# Altium schematic sheet MCont_V1.0.SchDoc
size 381 x 241 mm; SheetNumber: 1; SheetTotal: 5
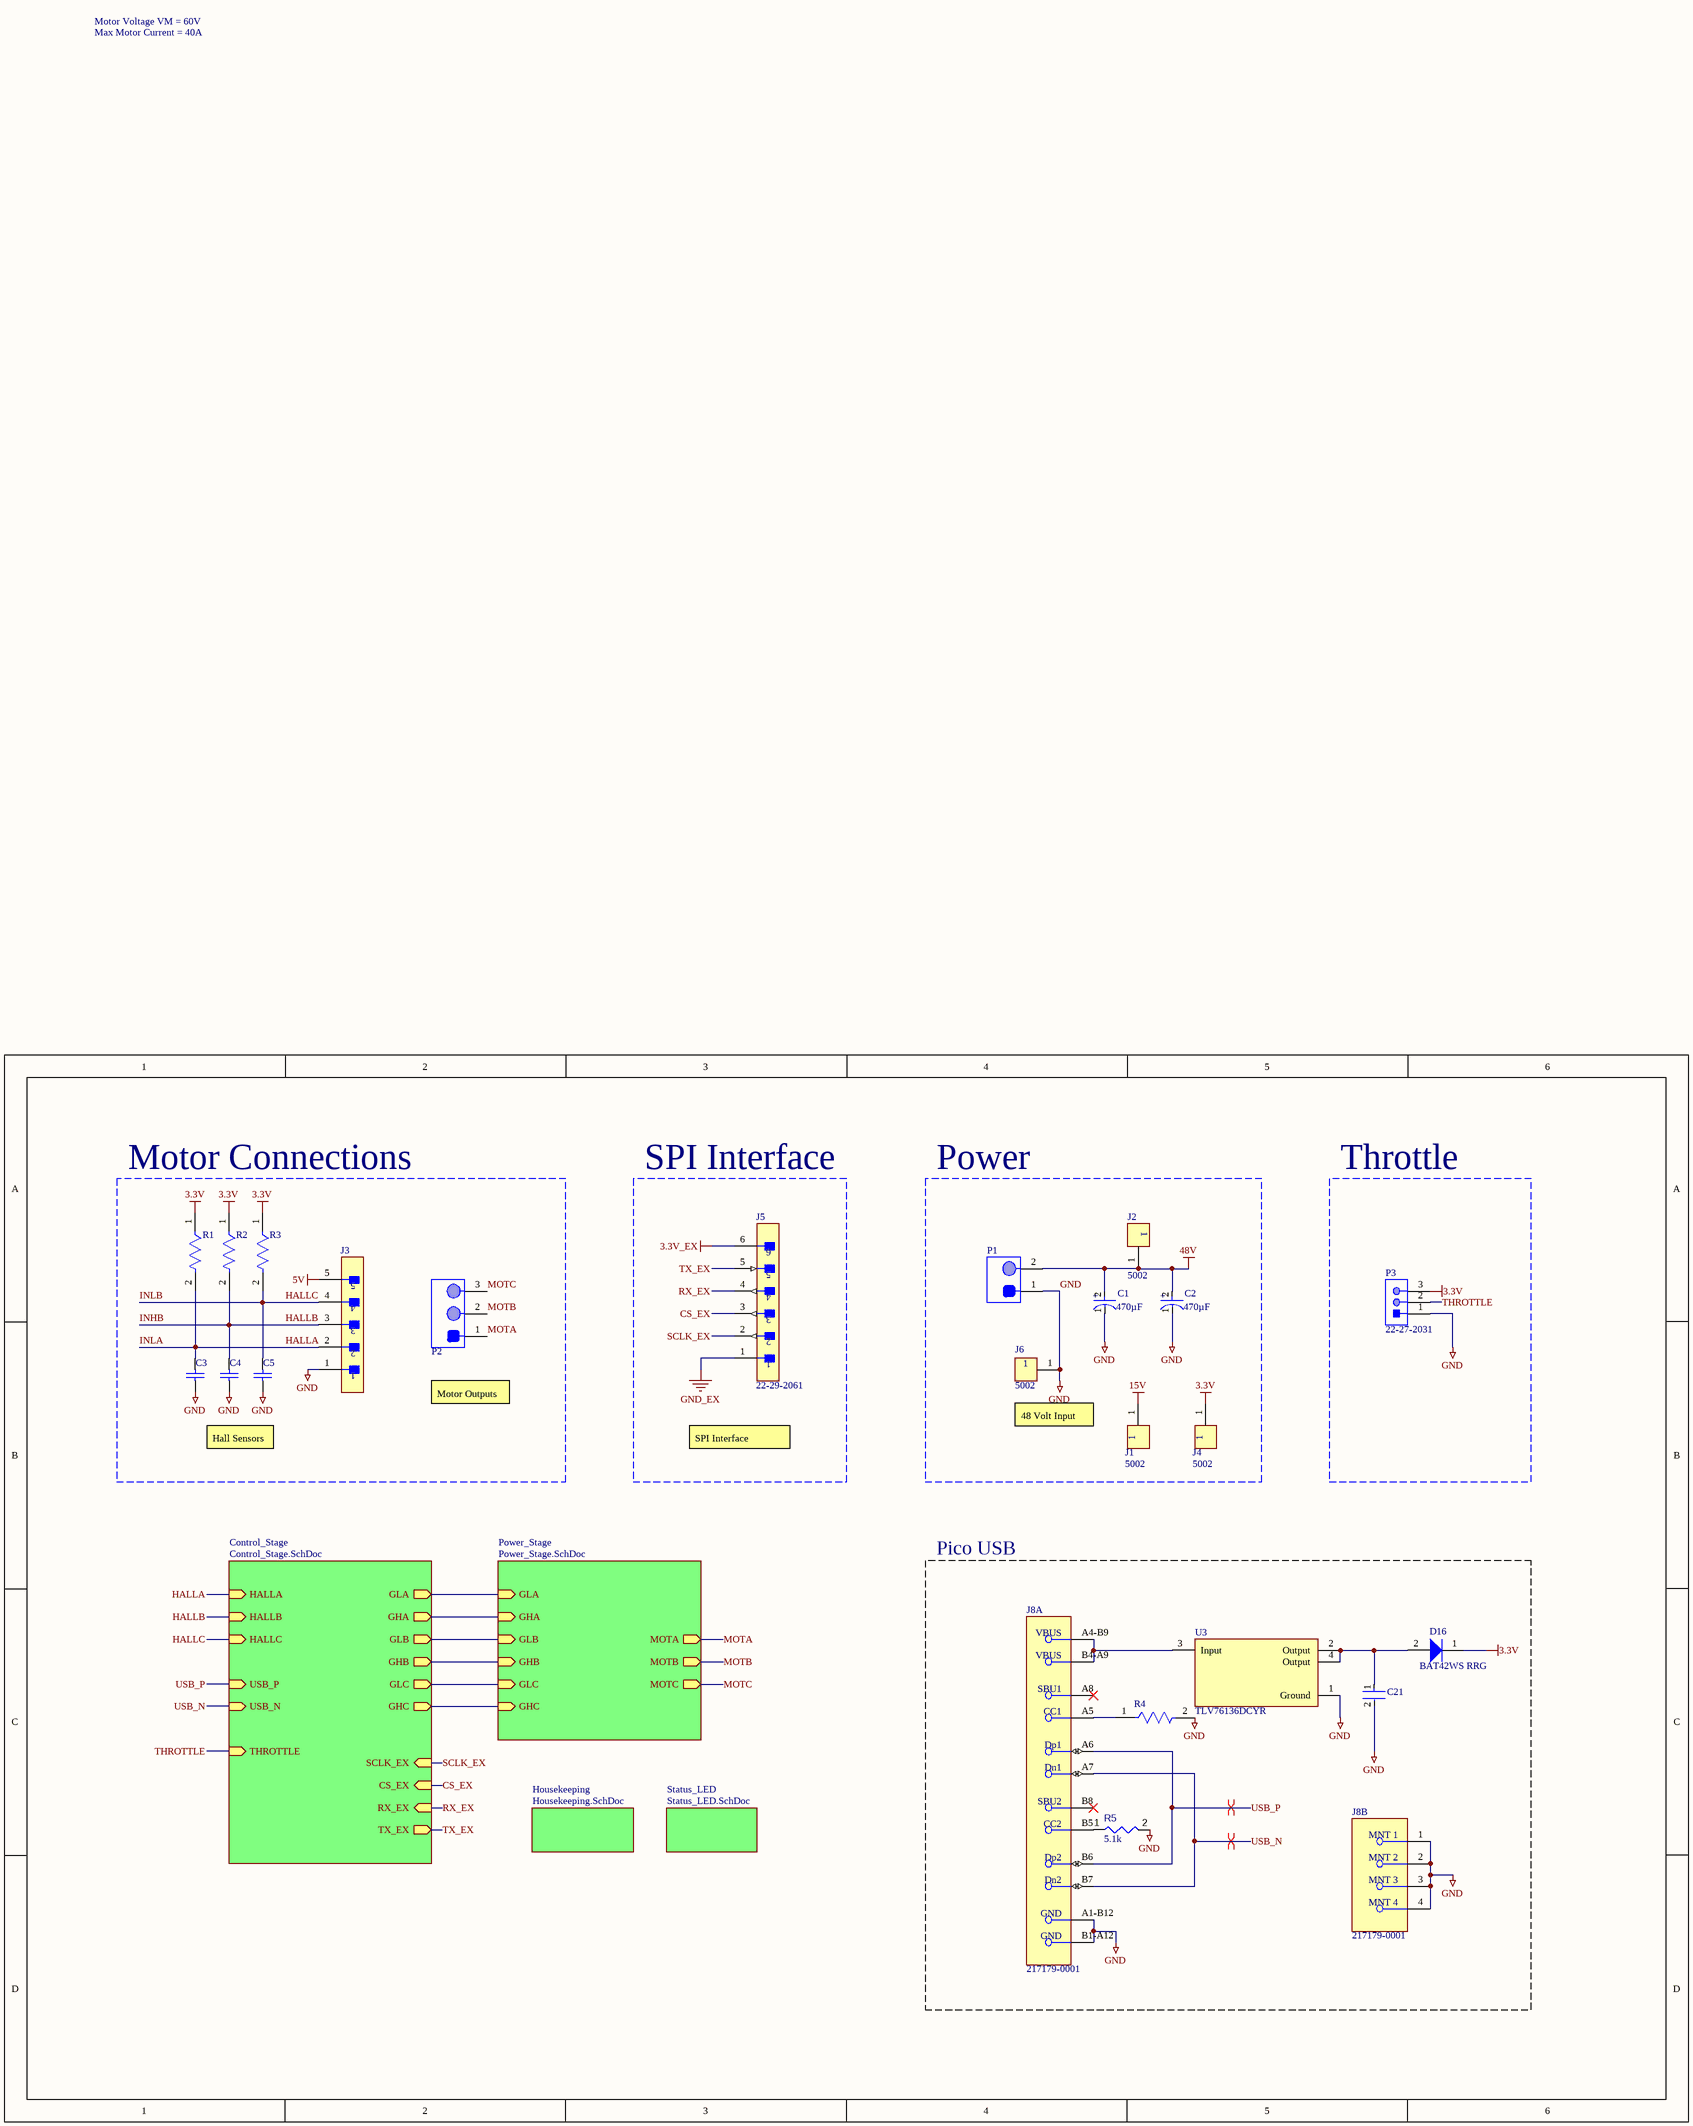
[diagram p0: MCont_V1.0.SchDoc]

## Parts
C1  Capacitance: 470µF  [FP-ESH477M100AM2AA-MFG]  (hidden comment: ESH477M100AM2AA)
C2  Capacitance: 470µF  [FP-ESH477M100AM2AA-MFG]  (hidden comment: ESH477M100AM2AA)
C3  VJ0603Y102KXACW1BC  [CAPC1608X95X40NL15T15]  (value not drawn)
C4  VJ0603Y102KXACW1BC  [CAPC1608X95X40NL15T15]  (value not drawn)
C5  VJ0603Y102KXACW1BC  [CAPC1608X95X40NL15T15]  (value not drawn)
C21  CC0603KRX5R6BB106  [FP-CC0603-DC-MFG]  (value not drawn)
D16  BAT42WS RRG  [BAT42WS RRG-Footprint-1]
J1  5002  [FP-5002-MFG]
J2  5002  [FP-5002-MFG]
J3  22-29-2051  [FP-22-29-2051-MFG]  (value not drawn)
J4  5002  [FP-5002-MFG]
J5  22-29-2061  [FP-22-29-2061-MFG]
J6  5002  [FP-5002-MFG]
J8  217179-0001  [FP-2171790001-MFG]  (parts A,B of 2)
P1  VP0265540000G  [VP0265540000G-Footprint-1]  (value not drawn)
P2  VP0365540000G  [VP0365540000G-Footprint-1]  (value not drawn)
P3  22-27-2031  [MOLX-22-27-2031_V]
R1  RC0603FR-0710KL  [FP-RC0603-0_55-IPC_C]  (value not drawn)
R2  RC0603FR-0710KL  [FP-RC0603-0_55-IPC_C]  (value not drawn)
R3  RC0603FR-0710KL  [FP-RC0603-0_55-IPC_C]  (value not drawn)
R4  ERJ-3EKF5101V  [FP-ERJ3EK-MFG]  (value not drawn)
R5  value 5.1k  [FP-ERJ3EK-IPC_A]  (hidden comment: ERJ-3EKF5101V)
U3  TLV76136DCYR  [TLV76136DCYR-Footprint-1]

## Blocks framed on the sheet
Motor Connections: C3-C5 J3 P2 R1-R3
SPI Interface: J5
Power: C1 C2 J1 J2 J4 J6 P1
Throttle: P3
Pico USB: C21 D16 J8 R4 R5 U3

## Sub-sheets
Control_Stage = Control_Stage.SchDoc: HALLA (in), HALLB (in), HALLC (in), USB_P (in), USB_N (in), GLA (out), GHA (out), GLB (out), GHB (out), GLC (out), GHC (out), THROTTLE (in), SCLK_EX (in), CS_EX (in), RX_EX (in), TX_EX (out)
Housekeeping = Housekeeping.SchDoc: no entries
Power_Stage = Power_Stage.SchDoc: MOTA (out), MOTB (out), MOTC (out), GLA (in), GHA (in), GLB (in), GHB (in), GLC (in), GHC (in)
Status_LED = Status_LED.SchDoc: no entries

## Nets
3.3V: D16.1(K) J4.1 P3.3 R1.1 R2.1 R3.1
3.3V_EX: J5.6
5V: J3.5
15V: J1.1
48V: C1.2(A) C2.2(A) J2.1 P1.2
GND: C1.1(C) C2.1(C) C3.1 C4.1 C5.1 C21.2 J3.1 J6.1 J8.1(MNT_1) J8.2(MNT_2) J8.3(MNT_3) J8.4(MNT_4) J8.A1-B12(GND) J8.B1-A12(GND) P1.1 P3.1 R4.2 R5.2 U3.1(Ground)
GND_EX: J5.1
CS_EX: J5.3 ; sheet Control_Stage/CS_EX
HALLA: C3.2 J3.2 R1.2 ; sheet Control_Stage/HALLA  [also labelled INLA]
HALLB: C4.2 J3.3 R2.2 ; sheet Control_Stage/HALLB  [also labelled INHB]
HALLC: C5.2 J3.4 R3.2 ; sheet Control_Stage/HALLC  [also labelled INLB]
MOTA: P2.1 ; sheet Power_Stage/MOTA
MOTB: P2.2 ; sheet Power_Stage/MOTB
MOTC: P2.3 ; sheet Power_Stage/MOTC
RX_EX: J5.4 ; sheet Control_Stage/RX_EX
SCLK_EX: J5.2 ; sheet Control_Stage/SCLK_EX
THROTTLE: P3.2 ; sheet Control_Stage/THROTTLE
TX_EX: J5.5 ; sheet Control_Stage/TX_EX
USB_N: J8.A7(Dn1) J8.B7(Dn2) ; sheet Control_Stage/USB_N
USB_P: J8.A6(Dp1) J8.B6(Dp2) ; sheet Control_Stage/USB_P
NetC21_1: C21.1 D16.2(A) U3.2(Output) U3.4(Output)
NetJ8_A4-B9: J8.A4-B9(VBUS) J8.B4-A9(VBUS) U3.3(Input)
NetJ8_A5: J8.A5(CC1) R4.1
NetJ8_B5: J8.B5(CC2) R5.1
(unnamed): sheet Power_Stage/GLA, sheet Control_Stage/GLA
(unnamed): sheet Power_Stage/GHA, sheet Control_Stage/GHA
(unnamed): sheet Power_Stage/GLB, sheet Control_Stage/GLB
(unnamed): sheet Power_Stage/GHB, sheet Control_Stage/GHB
(unnamed): sheet Power_Stage/GLC, sheet Control_Stage/GLC
(unnamed): sheet Power_Stage/GHC, sheet Control_Stage/GHC

Not connected (* = marked no-connect by the designer): J8 A8(SBU1)* B8(SBU2)*

## Layout directives
differential pair: USB_N, USB_P

## Notes on the sheet
- Motor Voltage VM = 60V
- Max Motor Current = 40A
- Motor Outputs
- Hall Sensors
- SPI Interface
- 48 Volt Input
- (in symbol CMP-00212-26722299-1) +

## Library data of the parts
C1 C2 = CMP-00212-26722299-1: ESH477M100AM2AA Radial Can ALUMINUM ELECTROLYTIC CAPACITOR ESH 100V 470muF ±20% 0.630Dia 16.00mm; Life (Hours): 2000hours; Case/Package: Radial; Height: 32mm; REACH SVHC: No SVHC; Voltage Rating: 100V; Min Operating Temperature: -25°C; Diameter: 16mm; Voltage Rating (DC): 100V; Max Operating Temperature: 105°C; RoHS: Compliant; Packaging: Tape & Reel; Tolerance: 20%; Lead Pitch: 7.5mm; NexarPartId: 26722299
C3-C5 = CMP-2006-02121-1: Manufacturer: Vitramon; Part Number: VJ0603Y102KXACW1BC
C21 = CMP-03422-001507-1: CAP CER 10UF 10V X5R 0603; Tolerance: 10%; Case/Package: 0603; Length: 0.063inch; Capacitance: 10uF; Dielectric: X5R; Mount: Surface Mount; Case Code (Metric): 1608; Depth: 0.8mm; Voltage Rating (DC): 10V; Voltage Rating: 10V; Lead Free: Lead Free; Resistor Type: Ceramic; Packaging: Tape and Reel; Max Operating Temperature: 85°C; Termination: SMD/SMT; Min Operating Temperature: -55°C; Weight: 7.1E-05oz; Thickness: 0.035inch; Case Code (Imperial): 0603; Package Quantity: 4000; Halogen Free: Halogen Free; RoHS Compliant: Yes; Width: 0.031inch
D16 = CMP-004-00032-1: Schottky Diode, 30V, 0.2A, Sod-323F Rohs Compliant: Yes; Manufacturer Lifecycle Status: ACTIVE; Lifecycle Status: Production
J1 J2 J4 J6 = CMP-2000-05182-2: PC TEST POINT MINIATURE WHITE; Body Material: Bronze; Insulation: Insulated; Inside Diameter: 1.27mm; Number of Ports: 1; Outside Diameter: 2.54mm; Hole Diameter: 1.6mm; Plating: Silver; Contact Plating: Silver; Orientation: Straight; REACH SVHC: No SVHC; Series: THM; Packaging: Bulk; Material: Nylon; Flammability Rating: UL94 V-0; Mount: Through Hole; Color: White; Housing Color: White; Length: 7.62mm; Contact Material: Bronze; Lead Free: Lead Free; Package Quantity: 100; RoHS Compliant: Yes
J3 = CMP-04776-000816-1: 2.54MM KK HDR VT FRICLK VRA .5AU; Number of Circuits: 5; Connector Type: Male Pin; Max Current Rating: 7A; Glow Wire Compliant: Non-compliant; Insulation Resistance: 50GR; Gender: Male; Current Rating: 4A; Number of Lines: 1; Max Voltage Rating (AC): 250V; Contact Resistance: 10mR; Orientation: Straight; Height: 14.73mm; Contact Plating: Gold; Series: KK® 6410; Number of Poles: 5; Mount: Through Hole; Length: 12.7mm; Packaging: Bulk; Package Quantity: 10; Depth: 5.8mm; Housing Color: White; Pitch: 2.54mm; Number of Positions: 5; Contact Mating Length: 0.295inch; Max Operating Temperature: 75°C; Housing Material: Nylon; Termination: Solder; Contact Material: Brass; Flammability Rating: UL94 V-0; Number of Contacts: 5; Color: Natural; Min Operating Temperature: 0°C; Radiation Hardening: No; Contact Type: Male Pin; Number of Rows: 1; Voltage Rating: 250V; Voltage Rating (DC): 250V; Contact Gender: Male; Fastening Type: Friction; Lead Free: Lead Free; Halogen Free: Low Halogen
J5 = CMP-04776-000348-1: CONN HEADER VERT 6POS 2.54MM; Gender: Male; Number of Poles: 6; Voltage Rating: 250V; Insulation Resistance: 50GR; Contact Resistance: 10mR; Current Rating: 4A; Number of Lines: 1; Height: 11.7mm; Mount: Through Hole; Length: 15.24mm; Contact Plating: Gold; Contact Type: Male Pin; Contact Material: Brass; Housing Material: Nylon; Series: KK® 6410; Number of Positions: 6; Contact Mating Length: 0.295inch; Fastening Type: Friction; RoHS Compliant: Yes; Color: Natural; Max Operating Temperature: 75°C; Contact Gender: Male; Packaging: Bulk; Termination: Solder; Voltage Rating (DC): 250V; Orientation: Straight; Radiation Hardening: No; Flammability Rating: UL94 V-0; Package Quantity: 1000; Housing Color: White; Number of Rows: 1; Min Operating Temperature: 0°C; Max Current Rating: 4A; Pitch: 2.54mm; Depth: 5.8mm; Number of Contacts: 6; Lead Free: Lead Free
J8 = CMP-04767-000028-2: CONN RCP USB2.0 TYP C 24P SMD RA; NexarPartId: 117190526; Gender: Receptacle; Number of Contacts: 16; Current Rating: 1.25A; Voltage Rating: 30V; Min Operating Temperature: -40°C; USB Standard: USB 2.0; Height: 3.36mm; Contact Material: Gold, Nickel; Max Operating Temperature: 85°C
P1 = CMP-002-00073-1: VP10.16-2P slot screws Cr3+ zinc, solder foot bright tin, steel stamping clamp; RoHS Compliant: Yes
P2 = CMP-002-00077-2: VP10.16-3P slot screws Cr3 zinc, solder foot bright tin, steel stamping clamp; RoHS Compliant: Yes
P3 = CMP-2000-05538-1: Male Header, Pitch 2.54 mm, 1 x 3 Position, Height 11.7 mm, Tail Length 3.56 mm, -40 to 80 degC, RoHS, Bulk; Manufacturer: Molex; Voltage rating: 250V; Current rating: 4A; Package Reference: 22-27-2031; Housing material: Nylon(UL94V-0); Operating temperature: 0°Cto+75°C; Package Description: Male Header, Pitch 2.54 mm, 1 x 3 Position, Height 11.7 mm, Tail Length 3.56 mm; Package URL: http://www.molex.com/pdm_docs/sd/022272031_sd.pdf; Datasheet Version: 06/2016; Manufacturer URL: http://www.molex.com/; Mounting Technology: ThroughHole; Datasheet URL: http://www.molex.com/webdocs/datasheets/pdf/en-us/0022272031_PCB_HEADERS.pdf; Contact material: Tinplatedbrass
R1-R3 = CMP-2100-03664-2: RES 10K OHM 1% 1/10W 0603; Voltage Rating: 75V; Voltage Rating (DC): 50V; Resistance: 10kR; Power Rating: 100mW; Temperature Coefficient: 100ppm/°C; Depth: 0.8mm; Termination: SMD/SMT; Resistor Type: Thick Film; Series: RC; Construction: Rectangular; Features: Moisture Resistant; Packaging: Tape and Reel; Min Operating Temperature: -55°C; Number of Terminations: 2; Lead Pitch: 0.3mm; RoHS Compliant: Yes; Case/Package: 0603; Resistance Tolerance: 1%; Military Standard: Not; Weight: 7.1E-05oz; Number of Pins: 2; Tolerance: 1%; Length: 1.6mm; Case Code (Imperial): 0603; Lead Free: Lead Free; Width: 0.8mm; Max Power Dissipation: 100mW; Height: 0.45mm; Max Operating Temperature: 155°C; Case Code (Metric): 1608; Size Code: 0603
R4 = CMP-2000-00540-8: RES SMD 5.1K OHM 1% 1/10W 0603; Power Rating: 100mW; Temperature Coefficient: 100ppm/°C; Voltage Rating: 75V; Resistance: 5.1kR; Military Standard: Not; Case/Package: 0603; Packaging: Tape and Reel; Package Quantity: 1; Reach SVHC Compliant: Yes; Lead Free: Lead Free; Mount: Surface Mount; Size Code: 0603; Depth: 0.8mm; Resistance Tolerance: 1%; Number of Terminations: 2; Resistor Type: Thick Film; Width: 0.8mm; Construction: Rectangular; Series: ERJ; Radiation Hardening: No; Max Operating Temperature: 155°C; Features: Automotive AEC-Q200; Tolerance: 1%; Voltage Rating (DC): 75V; Length: 1.6mm; RoHS Compliant: Yes; Min Operating Temperature: -55°C; Case Code (Metric): 1608; Termination: SMD/SMT; Weight: 7.1E-05oz; Max Power Dissipation: 100mW; Contact Plating: Tin; Height: 0.022inch; Case Code (Imperial): 0603
R5 = CMP-009-00178-1: Fixed Resistor, Metal Glaze/thick Film, 0.1W, 5100ohm, 75V, 1% +/-Tol, 100ppm/Cel, Surface Mount, 0603; Power: 100mW; Case/Package: 0603; Tolerance: 1%; Min Operating Temperature: -55°C; Max Operating Temperature: 155°C; RoHS Compliant: Yes; Mounting Technology: Surface Mount; Pins: 2
U3 = CMP-019-00054-3: 1A 16V high-PSRR linear voltage regulator 4-SOT-223 -40 to 125; Manufacturer Lifecycle Status: ACTIVE; Length: 6.5mm; RoHS: Compliant; Thickness: 1.6mm; Width: 3.5mm; Case/Package: SOT-223; Lifecycle Status: Production; Pins: 4; Height: 1.8mm